# Altium project PCB_Project1.PrjPCB
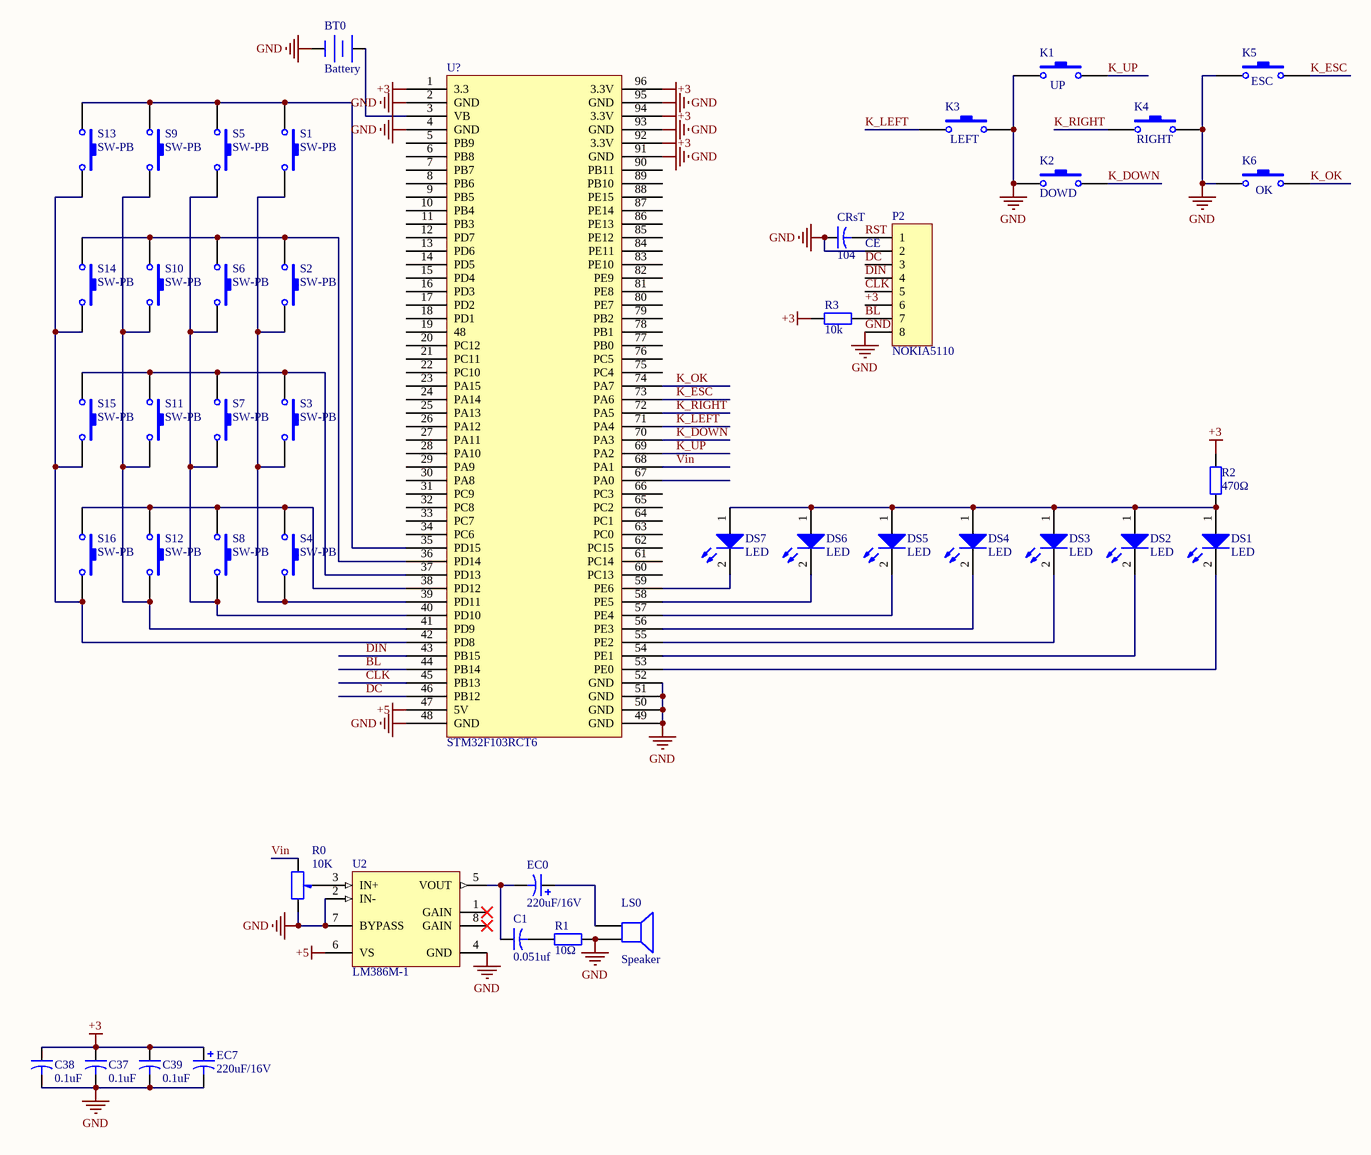
[diagram p0: Sheet1.SchDoc]
1 sheet, 45 parts. Net scope: global (net labels, ports and power ports of the same name join across sheets).
Board file: PCB1.PcbDoc

## Sheet Sheet1.SchDoc
size A3

### Parts
BT0  Battery  [CR2032]
C1  0.051uf  [RAD-0.2]
C37  0.1uF  [CC3216]
C38  0.1uF  [CC3216]
C39  0.1uF  [CC3216]
CRsT  104  [RAD-0.2]
DS1  LED  [LED-2]
DS2  LED  [LED-2]
DS3  LED  [LED-2]
DS4  LED  [LED-2]
DS5  LED  [LED-2]
DS6  LED  [LED-2]
DS7  LED  [LED-2]
EC0  220uF/16V  [RB3.0]
EC7  220uF/16V  [RB3.0]
K1  UP  [SPST-2]
K2  DOWD  [SPST-2]
K3  LEFT  [SPST-2]
K4  RIGHT  [SPST-2]
K5  ESC  [SPST-2]
K6  OK  [SPST-2]
LS0  Speaker  [PIN2]
P2  NOKIA5110  [HDR1X8]
R0  10K  [VR-3296]
R1  10Ω  [CR1206]
R2  470Ω  [CR1206]
R3  10k  [CR1206]
S1  SW-PB  [SPST-2]
S2  SW-PB  [SPST-2]
S3  SW-PB  [SPST-2]
S4  SW-PB  [SPST-2]
S5  SW-PB  [SPST-2]
S6  SW-PB  [SPST-2]
S7  SW-PB  [SPST-2]
S8  SW-PB  [SPST-2]
S9  SW-PB  [SPST-2]
S10  SW-PB  [SPST-2]
S11  SW-PB  [SPST-2]
S12  SW-PB  [SPST-2]
S13  SW-PB  [SPST-2]
S14  SW-PB  [SPST-2]
S15  SW-PB  [SPST-2]
S16  SW-PB  [SPST-2]
U1  STM32F103RCT6  [STM32F103RCT6]
U2  LM386M-1  [M08A_N]

### Nets
+3: C37.1 C38.1 C39.1 EC7.1 P2.6 R2.1 R3.1 U1.1(3.3) U1.92(3.3V) U1.94(3.3V) U1.96(3.3V)
+5: U1.47(5V) U2.6(VS)
GND: BT0.2(-) C37.2 C38.2 C39.2 CRsT.1 EC7.2 K1.1 K2.1 K3.2 K4.2 K5.1 K6.1 LS0.2 P2.2 P2.8 R0.1(TOP) R1.2 U1.2(GND) U1.4(GND) U1.48(GND) U1.49(GND) U1.50(GND) U1.51(GND) U1.52(GND) U1.91(GND) U1.93(GND) U1.95(GND) U2.2(IN-) U2.4(GND) U2.7(BYPASS)
BL: P2.7 R3.2 U1.44(PB14)
CLK: P2.5 U1.45(PB13)
DC: P2.3 U1.46(PB12)
DIN: P2.4 U1.43(PB15)
K_DOWN: K2.2 U1.70(PA3)
K_ESC: K5.2 U1.73(PA6)
K_LEFT: K3.1 U1.71(PA4)
K_OK: K6.2 U1.74(PA7)
K_RIGHT: K4.1 U1.72(PA5)
K_UP: K1.2 U1.69(PA2)
RST: CRsT.2 P2.1
Vin: R0.3(BOT) U1.68(PA1)
NetBT0_1: BT0.1(+) U1.3(VB)
NetC1_1: C1.1 EC0.2 U2.5(VOUT)
NetC1_2: C1.2 R1.1
NetDS1_1: DS1.1(A) DS2.1(A) DS3.1(A) DS4.1(A) DS5.1(A) DS6.1(A) DS7.1(A) R2.2
NetDS1_2: DS1.2(K) U1.53(PE0)
NetDS2_2: DS2.2(K) U1.54(PE1)
NetDS3_2: DS3.2(K) U1.55(PE2)
NetDS4_2: DS4.2(K) U1.56(PE3)
NetDS5_2: DS5.2(K) U1.57(PE4)
NetDS6_2: DS6.2(K) U1.58(PE5)
NetDS7_2: DS7.2(K) U1.59(PE6)
NetEC0_1: EC0.1 LS0.1
NetR0_2: R0.2(TAP) U2.3(IN+)
NetS1_1: S1.1 S5.1 S9.1 S13.1 U1.35(PD15)
NetS1_2: S1.2 S2.2 S3.2 S4.2 U1.39(PD11)
NetS2_1: S2.1 S6.1 S10.1 S14.1 U1.36(PD14)
NetS3_1: S3.1 S7.1 S11.1 S15.1 U1.37(PD13)
NetS4_1: S4.1 S8.1 S12.1 S16.1 U1.38(PD12)
NetS5_2: S5.2 S6.2 S7.2 S8.2 U1.40(PD10)
NetS9_2: S9.2 S10.2 S11.2 S12.2 U1.41(PD9)
NetS13_2: S13.2 S14.2 S15.2 S16.2 U1.42(PD8)

Not connected (* = marked no-connect by the designer): U1 5(PB9) 6(PB8) 7(PB7) 8(PB6) 9(PB5) 10(PB4) 11(PB3) 12(PD7) 13(PD6) 14(PD5) 15(PD4) 16(PD3) 17(PD2) 18(PD1) 19(48) 20(PC12) 21(PC11) 22(PC10) 23(PA15) 24(PA14) 25(PA13) 26(PA12) 27(PA11) 28(PA10) 29(PA9) 30(PA8) 31(PC9) 32(PC8) 33(PC7) 34(PC6) 60(PC13) 61(PC14) 62(PC15) 63(PC0) 64(PC1) 65(PC2) 66(PC3) 67(PA0) 75(PC4) 76(PC5) 77(PB0) 78(PB1) 79(PB2) 80(PE7) 81(PE8) 82(PE9) 83(PE10) 84(PE11) 85(PE12) 86(PE13) 87(PE14) 88(PE15) 89(PB10) 90(PB11); U2 1(GAIN)* 8(GAIN)*

### Notes on the sheet
- CE

### Library data of the parts
BT0 = CR2032
C1 CRsT = Cap: Capacitor; Value: 100pF; Published: 23-Sep-2002; PackageReference: CAPR5-4X5; Publisher: Altium Limited
C37-C39 = Cap: Capacitor; Published: 23-Sep-2002; PackageReference: CAPR5-4X5; Publisher: Altium Limited; Value: 0.1uF
EC0 EC7 = Cap Pol1: Polarized Capacitor (Radial); Published: 8-Jun-2000; LatestRevisionDate: 17-Jul-2002; LatestRevisionNote: Re-released for DXP Platform.; PackageReference: RB7.6-15; Publisher: Altium Limited; Value: 220uF/16V
K1-K6 S1-S16 = SW-PB: Switch; Published: 24-Mar-1999; LatestRevisionDate: 17-Jul-2002; LatestRevisionNote: Re-released for DXP Platform.; PackageReference: SPST-2; Publisher: Altium Limited; PackageDescription: Switch; 2 Leads
LS0 = Speaker: Loudspeaker; Published: 24-Mar-1999; LatestRevisionDate: 17-Jul-2002; LatestRevisionNote: Re-released for DXP Platform.; PackageReference: PIN2; Publisher: Altium Limited
P2 = Header 8: Header, 8-Pin; LatestRevisionDate: 17-Jul-2002; LatestRevisionNote: Re-released for DXP Platform.; Publisher: Altium Limited
R0 = Pot: Potentiometer
R1 R2 = Res2: Resistor; Value: 10K; Published: 8-Jun-2000; LatestRevisionDate: 17-Jul-2002; LatestRevisionNote: Re-released for DXP Platform.; PackageReference: AXIAL-0.4; Publisher: Altium Limited
R3 = Res2: Resistor; Published: 8-Jun-2000; LatestRevisionDate: 17-Jul-2002; LatestRevisionNote: Re-released for DXP Platform.; PackageReference: AXIAL-0.4; Publisher: Altium Limited; Value: 10K
U1 = STM32F103RC
U2 = LM386M-1: Low Voltage Audio Power Amplifier; Manufacturer: National Semiconductor; CompType: Audio IC; PackageTopMarking: NSZXTT*LM386*M-1; PowerWise: N; Published: 4-Dec-2008; DatasheetVersion: Aug-2000; PackageVersion: revL, Sep-2006; PackageReference: M08A; Publisher: Altium Limited; PackageDescription: SOIC Narrow, 4.9 x 3.9 x 1.45mm, 8 Lead, 1.27mm Pitch; PartNumber: LM386M-1; RoHS: O; PinCount: 8; DigiKeyPartNumber: LM386M-1-ND; Code_JEDEC: MS-012-AA; Code_IPC: SOIC127P600-8; ComponentLink1Description: LM386 Datasheet; ComponentLink1URL: http://www.national.com/ds/LM/LM386.pdf; ComponentLink2Description: LM386 Web Page; ComponentLink2URL: http://www.national.com/pf/LM/LM386.html; ComponentLink3Description: M08A Package Page; ComponentLink3URL: http://www.national.com/packaging/folders/m08a.html